# Altium schematic sheet Power.SchDoc
size A4
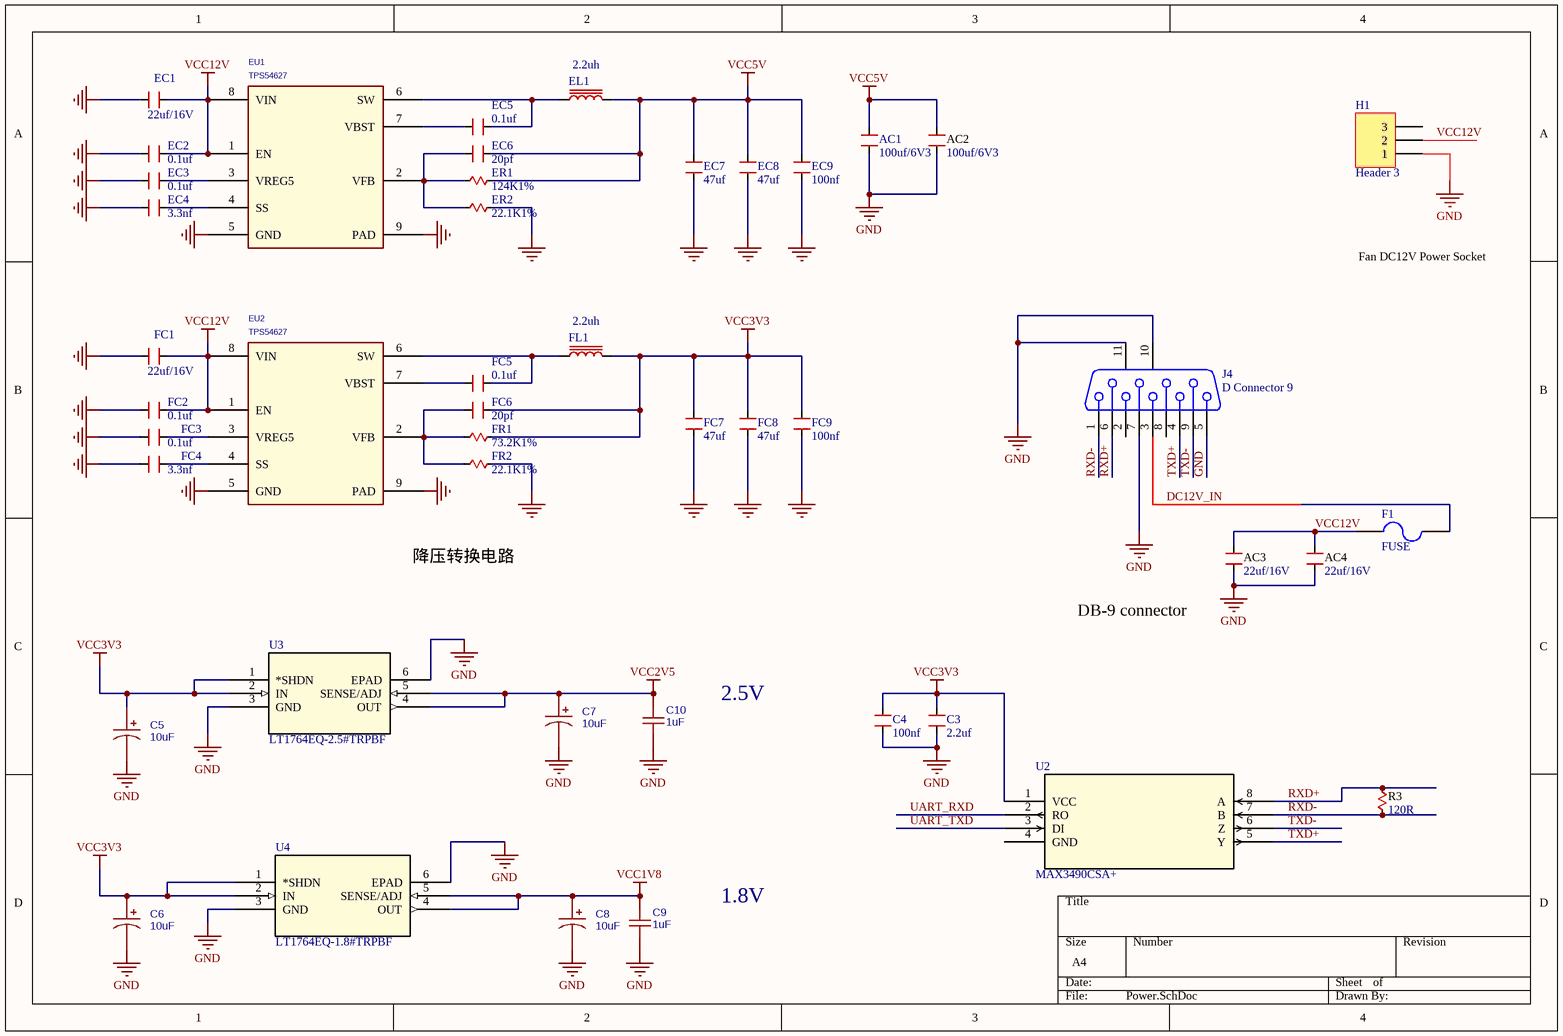
[diagram p0: Power.SchDoc]

## Parts
AC1  100uf/6V3  [CAP1206]
AC2  100uf/6V3  [CAP1206]
AC3  22uf/16V  [CAP1206]
AC4  22uf/16V  [CAP1206]
C3  2.2uf  [CAP0402]
C4  100nf  [CAP0402]
C5  10uF  [CASE-A_3216]
C6  10uF  [CASE-A_3216]
C7  10uF  [CASE-A_3216]
C8  10uF  [CASE-A_3216]
C9  1uF  [CAP0402]
C10  1uF  [CAP0402]
EC1  22uf/16V  [CAP1206]
EC2  0.1uf  [CAP0402]
EC3  0.1uf  [CAP0402]
EC4  3.3nf  [CAP0402]
EC5  0.1uf  [CAP0402]
EC6  20pf  [CAP0402]
EC7  47uf  [CAP0603]
EC8  47uf  [CAP0603]
EC9  100nf  [CAP0402]
EL1  2.2uh  [L4X4X2]
ER1  124K1%  [CAP0603]
ER2  22.1K1%  [CAP0603]
EU1  TPS54627  [SOP8_EP_127P4X5X1_5]
EU2  TPS54627  [SOP8_EP_127P4X5X1_5]
F1  FUSE  [1206]
FC1  22uf/16V  [CAP1206]
FC2  0.1uf  [CAP0402]
FC3  0.1uf  [CAP0402]
FC4  3.3nf  [CAP0402]
FC5  0.1uf  [CAP0402]
FC6  20pf  [CAP0402]
FC7  47uf  [CAP0603]
FC8  47uf  [CAP0603]
FC9  100nf  [CAP0402]
FL1  2.2uh  [L4X4X2]
FR1  73.2K1%  [CAP0603]
FR2  22.1K1%  [CAP0603]
H1  Header 3  [HDR1X3]
J4  D Connector 9  [DSUB1.385-2H9]
R3  120R  [RES0402]
U2  MAX3490CSA+  [21-0041B_8_MXM]
U3  LT1764EQ-2.5#TRPBF  [DDPAK-5_Q]
U4  LT1764EQ-1.8#TRPBF  [DDPAK-5_Q]

## Nets
GND: AC1.1 AC2.1 AC3.1 AC4.1 C3.2 C4.2 C5.2 C6.2 C7.2 C8.2 C9.1 C10.1 EC1.1 EC2.1 EC3.1 EC4.1 EC7.1 EC8.1 EC9.1 ER2.1 EU1.5(GND) EU1.9(PAD) EU2.5(GND) EU2.9(PAD) FC1.1 FC2.1 FC3.1 FC4.1 FC7.1 FC8.1 FC9.1 FR2.1 H1.1 J4.5 J4.7 J4.10(MH1) J4.11(MH2) U3.3(GND) U3.6(EPAD) U4.3(GND) U4.6(EPAD)
VCC1V8: C8.1 C9.2 U4.4(OUT) U4.5(SENSE/ADJ)
VCC2V5: C7.1 C10.2 U3.4(OUT) U3.5(SENSE/ADJ)
VCC3V3: C3.1 C4.1 C5.1 C6.1 FC6.2 FC7.2 FC8.2 FC9.2 FL1.2 FR1.1 U2.1(VCC) U3.1(*SHDN) U3.2(IN) U4.1(*SHDN) U4.2(IN)
VCC5V: AC1.2 AC2.2 EC6.2 EC7.2 EC8.2 EC9.2 EL1.2 ER1.1
VCC12V: AC3.2 AC4.2 EC1.2 EC2.2 EU1.1(EN) EU1.8(VIN) EU2.1(EN) EU2.8(VIN) F1.1 FC1.2 FC2.2 H1.2
DC12V_IN: F1.2 J4.3
RXD+: J4.6 R3.1 U2.8(A)
RXD-: J4.1 R3.2 U2.7(B)
TXD+: J4.4 U2.5(Y)
TXD-: J4.9 U2.6(Z)
UART_RXD: U2.2(RO)
UART_TXD: U2.3(DI)
NetEC3_2: EC3.2 EU1.3(VREG5)
NetEC4_2: EC4.2 EU1.4(SS)
NetEC5_1: EC5.1 EU1.7(VBST)
NetEC5_2: EC5.2 EL1.1 EU1.6(SW)
NetEC6_1: EC6.1 ER1.2 ER2.2 EU1.2(VFB)
NetEU2_2: EU2.2(VFB) FC6.1 FR1.2 FR2.2
NetEU2_3: EU2.3(VREG5) FC3.2
NetEU2_4: EU2.4(SS) FC4.2
NetEU2_6: EU2.6(SW) FC5.2 FL1.1
NetEU2_7: EU2.7(VBST) FC5.1

Not connected (* = marked no-connect by the designer): H1 3; J4 2 8; U2 4(GND)

## Notes on the sheet
- Fan DC12V Power Socket
- 降压转换电路
- (near AC3) DB-9 connector
- 2.5V
- 1.8V

## Library data of the parts
AC1 C3 EC1-EC9 FC1-FC9 = CAPACITOR: Generic Capacitor; DPN: *; Manufacturer: *
AC2-AC4 = CAPACITOR: Generic Capacitor; Value: 10nF; DPN: *; Manufacturer: *
C4 = CAPACITOR_1: Generic Capacitor; DPN: *; Manufacturer: *
C5-C8 = 150u: nameAlias: Value(F); Contributor: LCEDA_Lib; spicePre: C; spiceSymbolName: C_Tan_SMD_A_US
C9 C10 = 1u: nameAlias: Value(F); Contributor: LCEDA_Lib; spicePre: C; spiceSymbolName: C_0603_US
EL1 FL1 = Inductor: Generic Inductor; DPN: *; Manufacturer: *
ER1 ER2 FR1 FR2 = RESISTOR: Generic Resistor; Value: 4.7K; Manufacturer: *; DPN: *
EU1 EU2 = TPS54327
F1 = Fuse 2: Published: 8-Jun-2000; LatestRevisionDate: 17-Jul-2002; LatestRevisionNote: Re-released for DXP Platform.; PackageReference: PIN-W2/E2.8; Publisher: Altium Limited
H1 = Header 3: Header, 3-Pin; LatestRevisionDate: 17-Jul-2002; LatestRevisionNote: Re-released for DXP Platform.; Publisher: Altium Limited
J4 = D Connector 9: Receptacle Assembly, 9 Position, Right Angle; PackageDocument: O; Positions: 9; Published: 15-Jun-2001; LatestRevisionDate: 17-Jul-2002; LatestRevisionNote: Re-released for DXP Platform.; DatasheetDocument: 1-Sep-1999; PackageReference: 788750; Publisher: Altium Limited; Orientation: Right Angle; Gender: Receptacle
R3 = RESISTOR: Generic Resistor; Value: 10K; Manufacturer: *; DPN: *
U2 = MAX3490CSA+: No Description Available; Vendor: Maxim Integrated Products; Built_By: EMA_UL_Team; SourceLibrary: Maxim_2011-10-27; Manufacturer_Part_Number: MAX3490CSA+; Revision: 3; Copyright: Copyright (C) 2018 Accelerated Designs. All rights reserved; RefDes: RefDes; Type: DEV
U3 = LT1764EQ-2.5#TRPBF: No Description Available; Vendor: Linear Technology; Manufacturer_Part_Number: lt1764eq-2.5#trpbf; Copyright: Copyright (C) 2018 Accelerated Designs. All rights reserved; RefDes: RefDes; Type: DEV
U4 = LT1764EQ-1.8#TRPBF: No Description Available; Vendor: Linear Technology; Manufacturer_Part_Number: lt1764eq-1.8#trpbf; Copyright: Copyright (C) 2018 Accelerated Designs. All rights reserved; RefDes: RefDes; Type: DEV